# Altium schematic sheet 5-eMMC.SchDoc
size A4
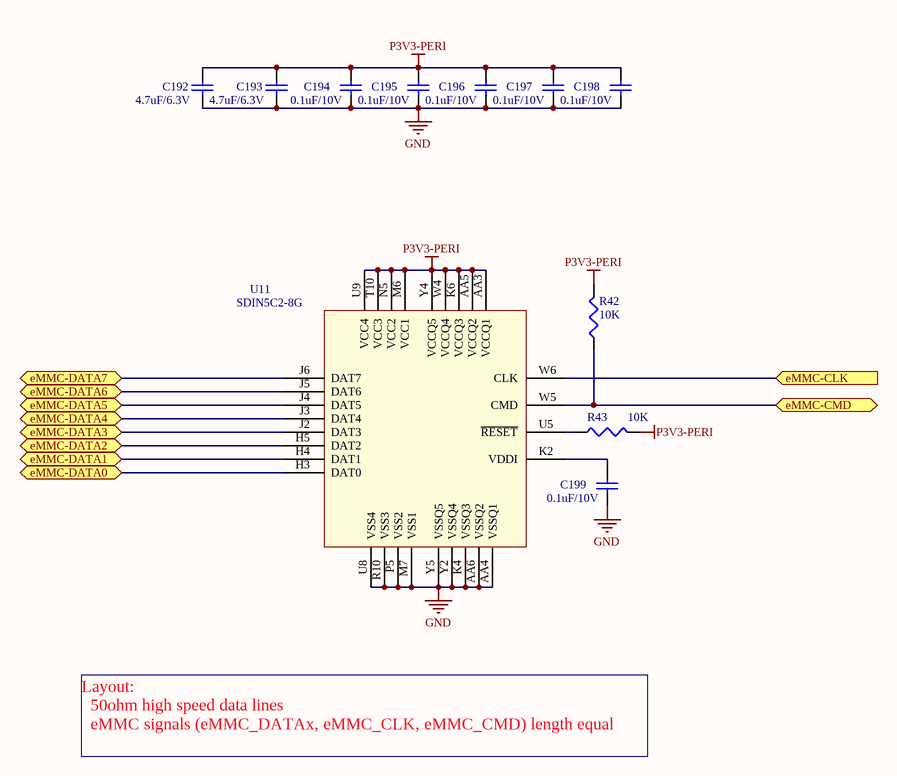
[diagram p0: 5-eMMC.SchDoc]

## Parts
C192  4.7uF/6.3V  [0603_CC]
C193  4.7uF/6.3V  [0603_CC]
C194  0.1uF/10V  [0402_CC]
C195  0.1uF/10V  [0402_CC]
C196  0.1uF/10V  [0402_CC]
C197  0.1uF/10V  [0402_CC]
C198  0.1uF/10V  [0402_CC]
C199  0.1uF/10V  [0402_CC]
R42  10K  [0402_CC]
R43  10K  [0402_CC]
U11  SDIN5C2-8G  [BGA169_0P5_12X16]

## Ports
eMMC-CLK (in), eMMC-CMD (bidir), eMMC-DATA0 (bidir), eMMC-DATA1 (bidir), eMMC-DATA2 (bidir), eMMC-DATA3 (bidir), eMMC-DATA4 (bidir), eMMC-DATA5 (bidir), eMMC-DATA6 (bidir), eMMC-DATA7 (bidir)

## Nets
GND: C192.2 C193.2 C194.2 C195.2 C196.2 C197.2 C198.2 C199.2 U11.AA4(VSSQ1) U11.AA6(VSSQ2) U11.K4(VSSQ3) U11.M7(VSS1) U11.P5(VSS2) U11.R10(VSS3) U11.U8(VSS4) U11.Y2(VSSQ4) U11.Y5(VSSQ5)
P3V3-PERI: C192.1 C193.1 C194.1 C195.1 C196.1 C197.1 C198.1 R42.2 R43.2 U11.AA3(VCCQ1) U11.AA5(VCCQ2) U11.K6(VCCQ3) U11.M6(VCC1) U11.N5(VCC2) U11.T10(VCC3) U11.U9(VCC4) U11.W4(VCCQ4) U11.Y4(VCCQ5)
eMMC-CLK: U11.W6(CLK) ; port eMMC-CLK
eMMC-CMD: R42.1 U11.W5(CMD) ; port eMMC-CMD
eMMC-DATA0: U11.H3(DAT0) ; port eMMC-DATA0
eMMC-DATA1: U11.H4(DAT1) ; port eMMC-DATA1
eMMC-DATA2: U11.H5(DAT2) ; port eMMC-DATA2
eMMC-DATA3: U11.J2(DAT3) ; port eMMC-DATA3
eMMC-DATA4: U11.J3(DAT4) ; port eMMC-DATA4
eMMC-DATA5: U11.J4(DAT5) ; port eMMC-DATA5
eMMC-DATA6: U11.J5(DAT6) ; port eMMC-DATA6
eMMC-DATA7: U11.J6(DAT7) ; port eMMC-DATA7
NetC199_1: C199.1 U11.K2(VDDI)
NetR43_1: R43.1 U11.U5(~{RESET})

## Notes on the sheet
- Layout:
  50ohm high speed data lines
  eMMC signals (eMMC_DATAx, eMMC_CLK, eMMC_CMD) length equal

## Library data of the parts
C192-C199 = Cap: Capacitor; Published: 8-Jun-2000; LatestRevisionDate: 17-Jul-2002; LatestRevisionNote: Re-released for DXP Platform.; PackageReference: RAD-0.3; Publisher: Altium Limited; PackageDescription: Radial Cap, Thru-Hole; 2 Leads; 0.3 in Pin Spacing
R42 R43 = Res3: Resistor; Published: 8-Jun-2000; LatestRevisionDate: 29-May-2009; LatestRevisionNote: IPC-7351 Footprint Added.; PackageReference: J1-0603; Publisher: Altium Limited; PackageDescription: Chip Resistor
U11 = SDIN5C2